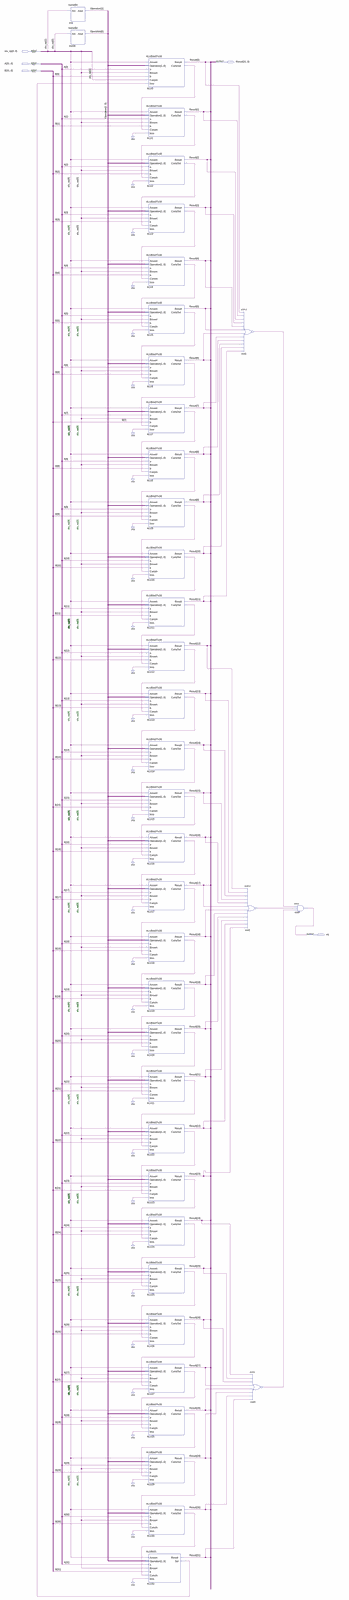
[diagram p0: schematic sheet, whole]
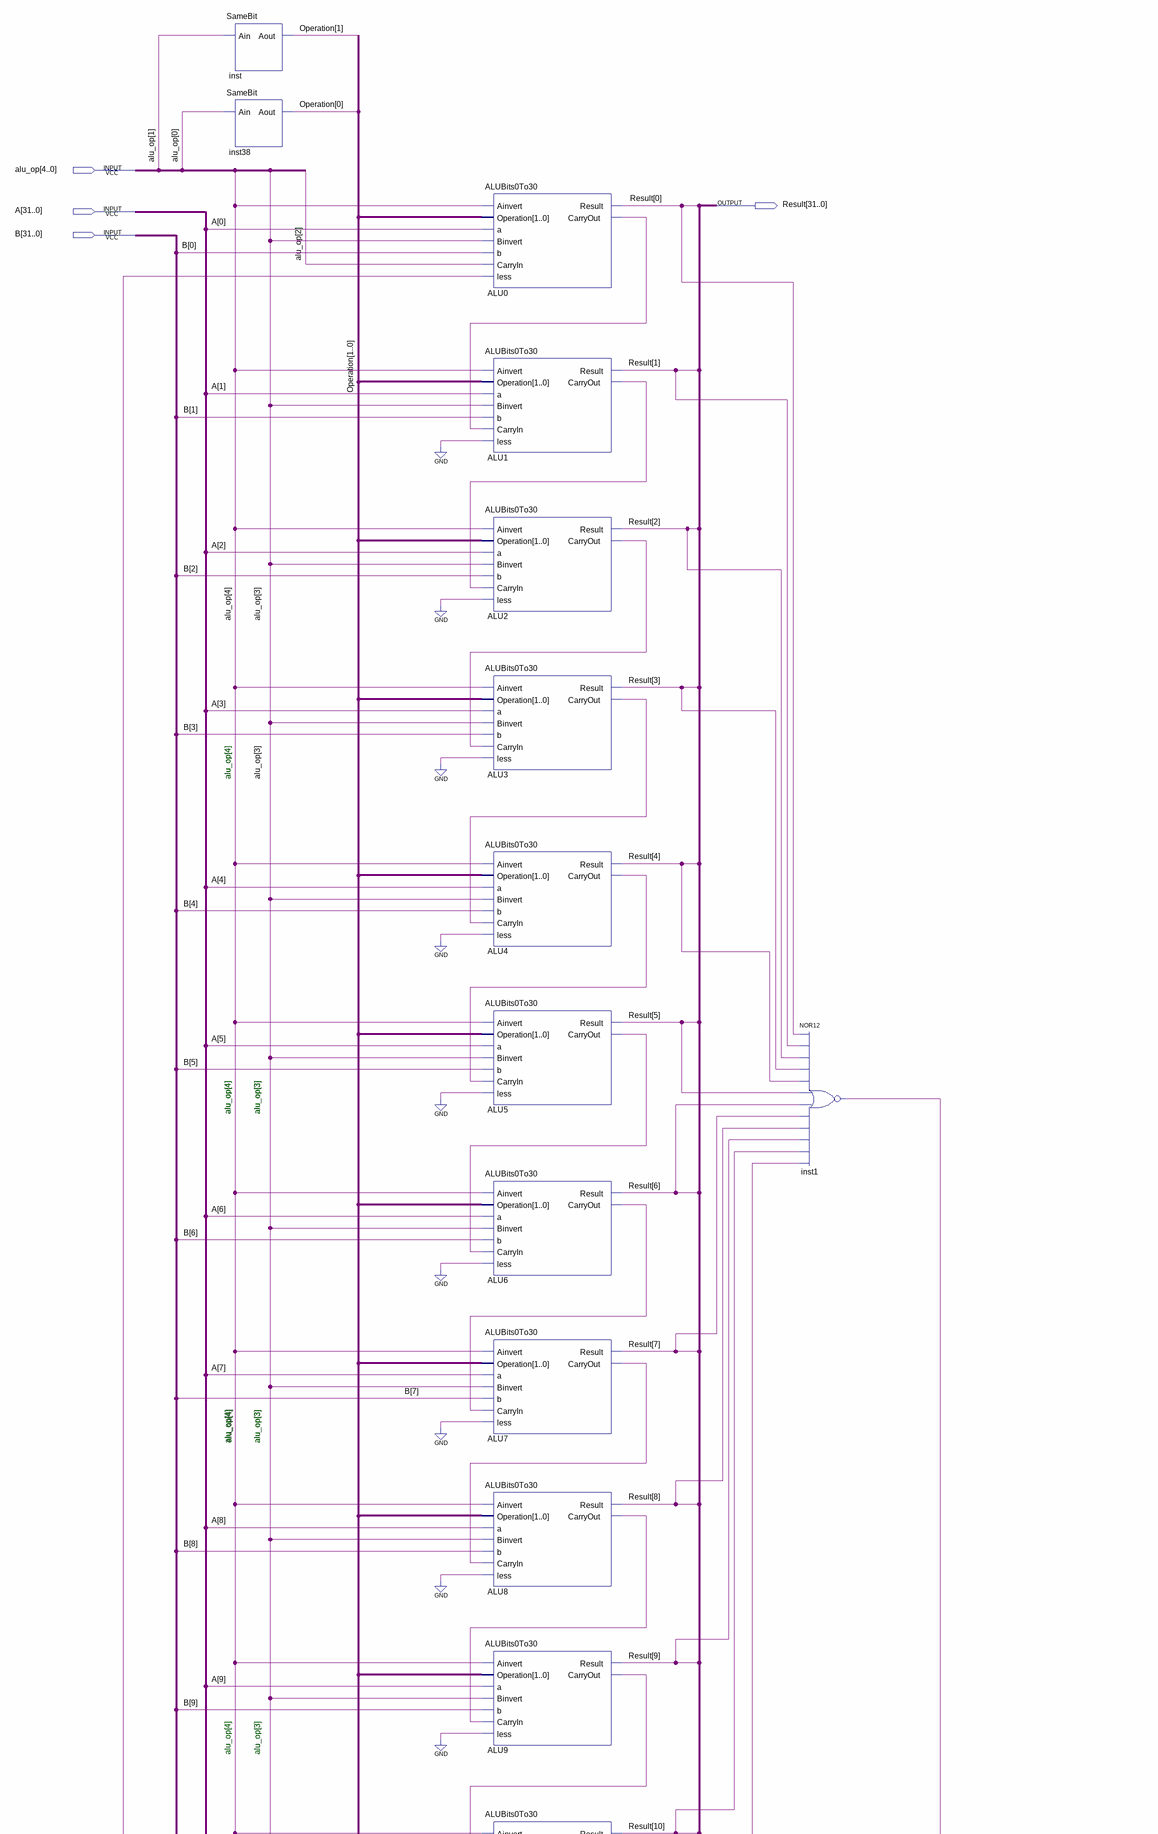
[diagram p1: schematic sheet, upper part]
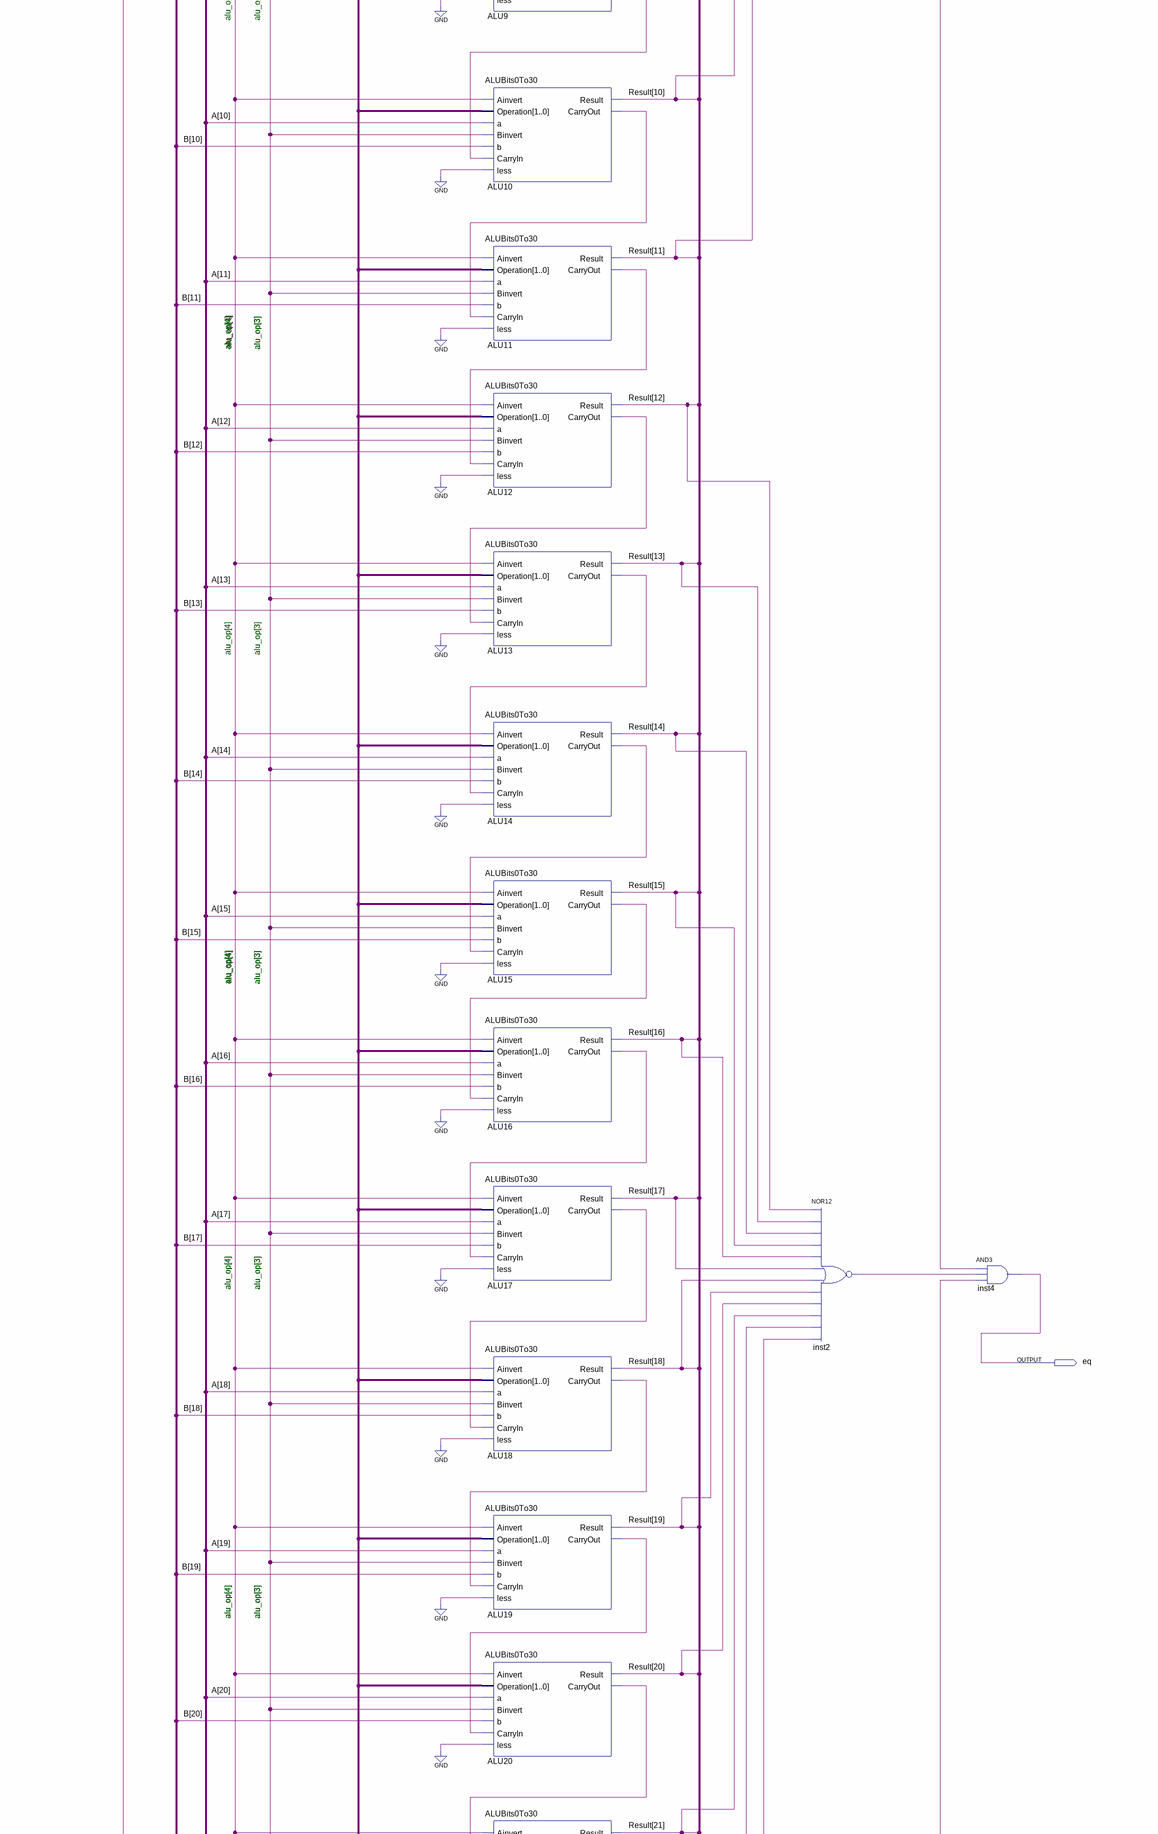
[diagram p2: schematic sheet, middle part]
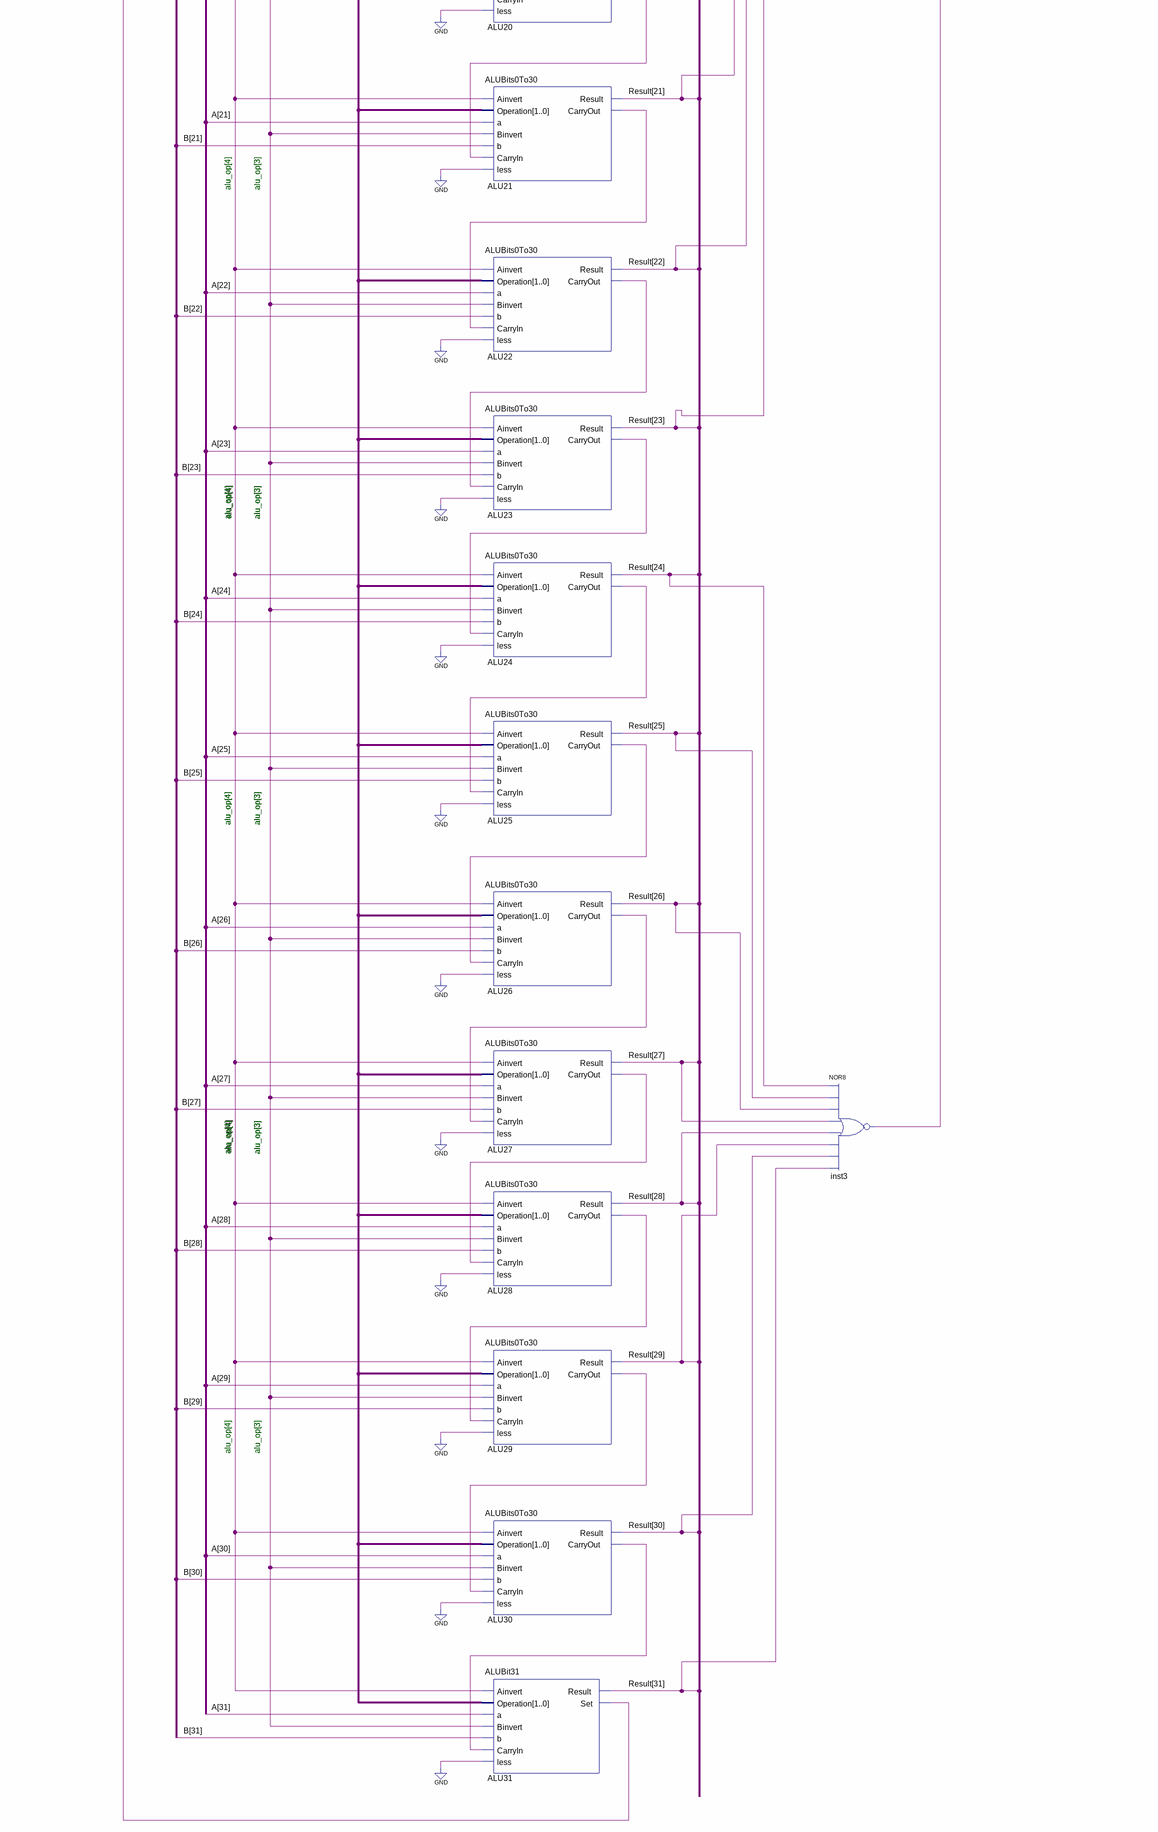
[diagram p3: schematic sheet, lower part]
// Quartus schematic ALU32.bdf as structural Verilog: 38 symbols, 5 pins
module ALU32 (
  input  [4:0] alu_op,
  input  [31:0] A,
  input  [31:0] B,
  output [31:0] Result,
  output eq
);

  wire ALU0_carryout, ALU1_carryout, ALU2_carryout, ALU3_carryout, ALU4_carryout, ALU5_carryout,
       ALU6_carryout, ALU7_carryout, ALU8_carryout, ALU9_carryout, ALU10_carryout, ALU11_carryout,
       ALU12_carryout, ALU13_carryout, ALU14_carryout, ALU15_carryout, ALU16_carryout, ALU17_carryout,
       ALU18_carryout, ALU19_carryout, ALU20_carryout, ALU21_carryout, ALU22_carryout, ALU23_carryout,
       ALU24_carryout, ALU25_carryout, ALU26_carryout, ALU27_carryout, ALU28_carryout, ALU29_carryout,
       ALU30_carryout, ALU31_set, inst1_out, inst2_out, inst3_out;
  wire [1:0] Operation;

  SameBit inst (.Ain(alu_op[1]), .Aout(Operation[1]));
  SameBit inst38 (.Ain(alu_op[0]), .Aout(Operation[0]));
  ALUBits0To30 ALU0 (
    .Ainvert(alu_op[4]), .Operation(Operation), .a(A[0]), .Binvert(alu_op[3]), .b(B[0]), .CarryIn(alu_op[2]),
    .less(ALU31_set), .Result(Result[0]), .CarryOut(ALU0_carryout));
  ALUBits0To30 ALU1 (
    .Ainvert(alu_op[4]), .Operation(Operation), .a(A[1]), .Binvert(alu_op[3]), .b(B[1]),
    .CarryIn(ALU0_carryout), .less(1'b0), .Result(Result[1]), .CarryOut(ALU1_carryout));
  ALUBits0To30 ALU2 (
    .Ainvert(alu_op[4]), .Operation(Operation), .a(A[2]), .Binvert(alu_op[3]), .b(B[2]),
    .CarryIn(ALU1_carryout), .less(1'b0), .Result(Result[2]), .CarryOut(ALU2_carryout));
  ALUBits0To30 ALU3 (
    .Ainvert(alu_op[4]), .Operation(Operation), .a(A[3]), .Binvert(alu_op[3]), .b(B[3]),
    .CarryIn(ALU2_carryout), .less(1'b0), .Result(Result[3]), .CarryOut(ALU3_carryout));
  ALUBits0To30 ALU4 (
    .Ainvert(alu_op[4]), .Operation(Operation), .a(A[4]), .Binvert(alu_op[3]), .b(B[4]),
    .CarryIn(ALU3_carryout), .less(1'b0), .Result(Result[4]), .CarryOut(ALU4_carryout));
  ALUBits0To30 ALU5 (
    .Ainvert(alu_op[4]), .Operation(Operation), .a(A[5]), .Binvert(alu_op[3]), .b(B[5]),
    .CarryIn(ALU4_carryout), .less(1'b0), .Result(Result[5]), .CarryOut(ALU5_carryout));
  ALUBits0To30 ALU6 (
    .Ainvert(alu_op[4]), .Operation(Operation), .a(A[6]), .Binvert(alu_op[3]), .b(B[6]),
    .CarryIn(ALU5_carryout), .less(1'b0), .Result(Result[6]), .CarryOut(ALU6_carryout));
  ALUBits0To30 ALU7 (
    .Ainvert(alu_op[4]), .Operation(Operation), .a(A[7]), .Binvert(alu_op[3]), .b(B[7]),
    .CarryIn(ALU6_carryout), .less(1'b0), .Result(Result[7]), .CarryOut(ALU7_carryout));
  ALUBits0To30 ALU8 (
    .Ainvert(alu_op[4]), .Operation(Operation), .a(A[8]), .Binvert(alu_op[3]), .b(B[8]),
    .CarryIn(ALU7_carryout), .less(1'b0), .Result(Result[8]), .CarryOut(ALU8_carryout));
  ALUBits0To30 ALU9 (
    .Ainvert(alu_op[4]), .Operation(Operation), .a(A[9]), .Binvert(alu_op[3]), .b(B[9]),
    .CarryIn(ALU8_carryout), .less(1'b0), .Result(Result[9]), .CarryOut(ALU9_carryout));
  ALUBits0To30 ALU10 (
    .Ainvert(alu_op[4]), .Operation(Operation), .a(A[10]), .Binvert(alu_op[3]), .b(B[10]),
    .CarryIn(ALU9_carryout), .less(1'b0), .Result(Result[10]), .CarryOut(ALU10_carryout));
  ALUBits0To30 ALU11 (
    .Ainvert(alu_op[4]), .Operation(Operation), .a(A[11]), .Binvert(alu_op[3]), .b(B[11]),
    .CarryIn(ALU10_carryout), .less(1'b0), .Result(Result[11]), .CarryOut(ALU11_carryout));
  ALUBits0To30 ALU12 (
    .Ainvert(alu_op[4]), .Operation(Operation), .a(A[12]), .Binvert(alu_op[3]), .b(B[12]),
    .CarryIn(ALU11_carryout), .less(1'b0), .Result(Result[12]), .CarryOut(ALU12_carryout));
  ALUBits0To30 ALU13 (
    .Ainvert(alu_op[4]), .Operation(Operation), .a(A[13]), .Binvert(alu_op[3]), .b(B[13]),
    .CarryIn(ALU12_carryout), .less(1'b0), .Result(Result[13]), .CarryOut(ALU13_carryout));
  ALUBits0To30 ALU14 (
    .Ainvert(alu_op[4]), .Operation(Operation), .a(A[14]), .Binvert(alu_op[3]), .b(B[14]),
    .CarryIn(ALU13_carryout), .less(1'b0), .Result(Result[14]), .CarryOut(ALU14_carryout));
  ALUBits0To30 ALU15 (
    .Ainvert(alu_op[4]), .Operation(Operation), .a(A[15]), .Binvert(alu_op[3]), .b(B[15]),
    .CarryIn(ALU14_carryout), .less(1'b0), .Result(Result[15]), .CarryOut(ALU15_carryout));
  ALUBits0To30 ALU16 (
    .Ainvert(alu_op[4]), .Operation(Operation), .a(A[16]), .Binvert(alu_op[3]), .b(B[16]),
    .CarryIn(ALU15_carryout), .less(1'b0), .Result(Result[16]), .CarryOut(ALU16_carryout));
  ALUBits0To30 ALU17 (
    .Ainvert(alu_op[4]), .Operation(Operation), .a(A[17]), .Binvert(alu_op[3]), .b(B[17]),
    .CarryIn(ALU16_carryout), .less(1'b0), .Result(Result[17]), .CarryOut(ALU17_carryout));
  ALUBits0To30 ALU18 (
    .Ainvert(alu_op[4]), .Operation(Operation), .a(A[18]), .Binvert(alu_op[3]), .b(B[18]),
    .CarryIn(ALU17_carryout), .less(1'b0), .Result(Result[18]), .CarryOut(ALU18_carryout));
  ALUBits0To30 ALU19 (
    .Ainvert(alu_op[4]), .Operation(Operation), .a(A[19]), .Binvert(alu_op[3]), .b(B[19]),
    .CarryIn(ALU18_carryout), .less(1'b0), .Result(Result[19]), .CarryOut(ALU19_carryout));
  ALUBits0To30 ALU20 (
    .Ainvert(alu_op[4]), .Operation(Operation), .a(A[20]), .Binvert(alu_op[3]), .b(B[20]),
    .CarryIn(ALU19_carryout), .less(1'b0), .Result(Result[20]), .CarryOut(ALU20_carryout));
  ALUBits0To30 ALU21 (
    .Ainvert(alu_op[4]), .Operation(Operation), .a(A[21]), .Binvert(alu_op[3]), .b(B[21]),
    .CarryIn(ALU20_carryout), .less(1'b0), .Result(Result[21]), .CarryOut(ALU21_carryout));
  ALUBits0To30 ALU22 (
    .Ainvert(alu_op[4]), .Operation(Operation), .a(A[22]), .Binvert(alu_op[3]), .b(B[22]),
    .CarryIn(ALU21_carryout), .less(1'b0), .Result(Result[22]), .CarryOut(ALU22_carryout));
  ALUBits0To30 ALU23 (
    .Ainvert(alu_op[4]), .Operation(Operation), .a(A[23]), .Binvert(alu_op[3]), .b(B[23]),
    .CarryIn(ALU22_carryout), .less(1'b0), .Result(Result[23]), .CarryOut(ALU23_carryout));
  ALUBits0To30 ALU24 (
    .Ainvert(alu_op[4]), .Operation(Operation), .a(A[24]), .Binvert(alu_op[3]), .b(B[24]),
    .CarryIn(ALU23_carryout), .less(1'b0), .Result(Result[24]), .CarryOut(ALU24_carryout));
  ALUBits0To30 ALU25 (
    .Ainvert(alu_op[4]), .Operation(Operation), .a(A[25]), .Binvert(alu_op[3]), .b(B[25]),
    .CarryIn(ALU24_carryout), .less(1'b0), .Result(Result[25]), .CarryOut(ALU25_carryout));
  ALUBits0To30 ALU26 (
    .Ainvert(alu_op[4]), .Operation(Operation), .a(A[26]), .Binvert(alu_op[3]), .b(B[26]),
    .CarryIn(ALU25_carryout), .less(1'b0), .Result(Result[26]), .CarryOut(ALU26_carryout));
  ALUBits0To30 ALU27 (
    .Ainvert(alu_op[4]), .Operation(Operation), .a(A[27]), .Binvert(alu_op[3]), .b(B[27]),
    .CarryIn(ALU26_carryout), .less(1'b0), .Result(Result[27]), .CarryOut(ALU27_carryout));
  ALUBits0To30 ALU28 (
    .Ainvert(alu_op[4]), .Operation(Operation), .a(A[28]), .Binvert(alu_op[3]), .b(B[28]),
    .CarryIn(ALU27_carryout), .less(1'b0), .Result(Result[28]), .CarryOut(ALU28_carryout));
  ALUBits0To30 ALU29 (
    .Ainvert(alu_op[4]), .Operation(Operation), .a(A[29]), .Binvert(alu_op[3]), .b(B[29]),
    .CarryIn(ALU28_carryout), .less(1'b0), .Result(Result[29]), .CarryOut(ALU29_carryout));
  ALUBits0To30 ALU30 (
    .Ainvert(alu_op[4]), .Operation(Operation), .a(A[30]), .Binvert(alu_op[3]), .b(B[30]),
    .CarryIn(ALU29_carryout), .less(1'b0), .Result(Result[30]), .CarryOut(ALU30_carryout));
  ALUBit31 ALU31 (
    .Ainvert(alu_op[4]), .Operation(Operation), .a(A[31]), .Binvert(alu_op[3]), .b(B[31]),
    .CarryIn(ALU30_carryout), .less(1'b0), .Result(Result[31]), .Set(ALU31_set));
  nor inst1 (inst1_out, Result[0], Result[1], Result[2], Result[3], Result[4], Result[5], Result[6], Result[7], Result[8], Result[9], Result[10], Result[11]);
  nor inst2 (inst2_out, Result[12], Result[13], Result[14], Result[15], Result[16], Result[17], Result[18], Result[19], Result[20], Result[21], Result[22], Result[23]);
  nor inst3 (inst3_out, Result[24], Result[25], Result[26], Result[27], Result[28], Result[29], Result[30], Result[31]);
  and inst4 (eq, inst1_out, inst2_out, inst3_out);

  // Notes on the sheet:
  //   alu_op[4]
  //   alu_op[4]
  //   alu_op[4]
  //   alu_op[3]
  //   alu_op[3]
  //   alu_op[4]
  //   alu_op[4]
  //   alu_op[3]
  //   alu_op[3]
  //   alu_op[4]
  //   alu_op[4]
  //   alu_op[3]
  //   alu_op[3]
  //   alu_op[4]
  //   alu_op[4]
  //   alu_op[4]
  //   alu_op[3]
  //   alu_op[3]
  //   alu_op[3]
  //   alu_op[4]
  //   alu_op[4]
  //   alu_op[3]
  //   alu_op[3]
  //   alu_op[4]
  //   alu_op[4]
  //   alu_op[4]
  //   alu_op[3]
  //   alu_op[3]
  //   alu_op[3]
  //   alu_op[4]
  //   alu_op[4]
  //   alu_op[3]
  //   alu_op[3]
  //   alu_op[4]
  //   alu_op[4]
  //   alu_op[4]
  //   alu_op[3]
  //   alu_op[3]
  //   alu_op[3]
  //   alu_op[4]
  //   alu_op[4]
  //   alu_op[3]
  //   alu_op[3]
  //   alu_op[4]
  //   alu_op[4]
  //   alu_op[4]
  //   alu_op[3]
  //   alu_op[3]
  //   alu_op[3]
  //   alu_op[4]
  //   alu_op[4]
  //   alu_op[3]
  //   alu_op[3]
  //   alu_op[4]
  //   alu_op[4]
  //   alu_op[4]
  //   alu_op[3]
  //   alu_op[3]
  //   alu_op[3]
  //   alu_op[4]
  //   alu_op[4]
  //   alu_op[3]
  //   alu_op[3]
endmodule
